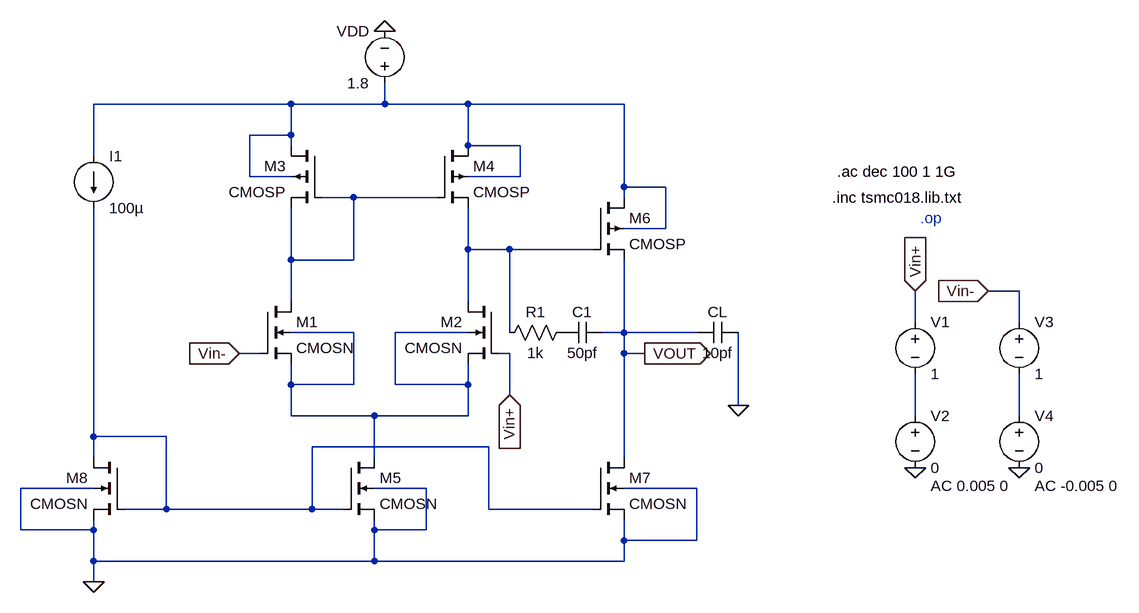
[diagram p0: schematic 2_stage_cmos_opamp.asc]
2_stage_cmos_opamp.asc, the LTspice schematic file:
Version 4.1
SHEET 1 1956 884
WIRE 672 -48 368 -48
WIRE 816 -48 816 -80
WIRE 816 -48 672 -48
WIRE 944 -48 816 -48
WIRE 1184 -48 944 -48
WIRE 672 0 672 -48
WIRE 672 0 608 0
WIRE 672 16 672 0
WIRE 944 16 944 -48
WIRE 1024 16 944 16
WIRE 368 32 368 -48
WIRE 608 64 608 0
WIRE 672 64 608 64
WIRE 1024 64 1024 16
WIRE 1024 64 944 64
WIRE 1184 80 1184 -48
WIRE 1248 80 1184 80
WIRE 768 96 720 96
WIRE 896 96 768 96
WIRE 1184 96 1184 80
WIRE 1248 144 1248 80
WIRE 1248 144 1184 144
WIRE 944 176 944 112
WIRE 1008 176 944 176
WIRE 1136 176 1008 176
WIRE 672 192 672 112
WIRE 768 192 768 96
WIRE 768 192 672 192
WIRE 1792 240 1744 240
WIRE 672 256 672 192
WIRE 944 256 944 176
WIRE 1632 288 1632 240
WIRE 1792 288 1792 240
WIRE 768 304 672 304
WIRE 944 304 832 304
WIRE 1008 304 1008 176
WIRE 1184 304 1184 192
WIRE 1184 304 1152 304
WIRE 1296 304 1184 304
WIRE 624 336 592 336
WIRE 1008 336 992 336
WIRE 1184 336 1184 304
WIRE 1216 336 1184 336
WIRE 672 384 672 352
WIRE 768 384 768 304
WIRE 768 384 672 384
WIRE 832 384 832 304
WIRE 944 384 944 352
WIRE 944 384 832 384
WIRE 1008 400 1008 336
WIRE 1360 416 1360 304
WIRE 672 432 672 384
WIRE 800 432 672 432
WIRE 944 432 944 384
WIRE 944 432 800 432
WIRE 1632 432 1632 368
WIRE 1792 432 1792 368
WIRE 368 464 368 112
WIRE 480 464 368 464
WIRE 976 480 704 480
WIRE 368 496 368 464
WIRE 800 496 800 432
WIRE 1184 496 1184 336
WIRE 368 544 256 544
WIRE 880 544 800 544
WIRE 1296 544 1184 544
WIRE 480 576 480 464
WIRE 480 576 416 576
WIRE 704 576 704 480
WIRE 704 576 480 576
WIRE 752 576 704 576
WIRE 976 576 976 480
WIRE 1136 576 976 576
WIRE 256 608 256 544
WIRE 368 608 368 592
WIRE 368 608 256 608
WIRE 800 608 800 592
WIRE 880 608 880 544
WIRE 880 608 800 608
WIRE 1184 624 1184 592
WIRE 1296 624 1296 544
WIRE 1296 624 1184 624
WIRE 368 656 368 608
WIRE 800 656 800 608
WIRE 800 656 368 656
WIRE 1184 656 1184 624
WIRE 1184 656 800 656
WIRE 368 688 368 656
FLAG 816 -160 0
FLAG 368 688 0
FLAG 1360 416 0
FLAG 592 336 Vin-
IOPIN 592 336 In
FLAG 1008 400 Vin+
IOPIN 1008 400 In
FLAG 1216 336 VOUT
IOPIN 1216 336 Out
FLAG 1632 240 Vin+
IOPIN 1632 240 In
FLAG 1744 240 Vin-
IOPIN 1744 240 In
FLAG 1632 512 0
FLAG 1792 512 0
SYMBOL voltage 816 -64 R180
WINDOW 0 24 96 Left 2
WINDOW 3 24 16 Left 2
SYMATTR InstName VDD
SYMATTR Value 1.8
SYMBOL nmos4 624 256 R0
SYMATTR InstName M1
SYMATTR Value CMOSN
SYMATTR Value2 l=0.5u w=20u
SYMBOL nmos4 992 256 M0
SYMATTR InstName M2
SYMATTR Value CMOSN
SYMATTR Value2 l=0.5u w=20u
SYMBOL nmos4 1136 496 R0
SYMATTR InstName M7
SYMATTR Value CMOSN
SYMATTR Value2 l=0.5u w=7u
SYMBOL nmos4 416 496 M0
SYMATTR InstName M8
SYMATTR Value CMOSN
SYMATTR Value2 l=0.72u w=10u
SYMBOL current 368 32 R0
WINDOW 123 0 0 Left 0
WINDOW 39 0 0 Left 0
SYMATTR InstName I1
SYMATTR Value 100µ
SYMBOL pmos4 1136 96 R0
SYMATTR InstName M6
SYMATTR Value CMOSP
SYMATTR Value2 l=0.5u w=40u
SYMBOL cap 1360 288 R90
WINDOW 0 0 32 VBottom 2
WINDOW 3 32 32 VTop 2
SYMATTR InstName CL
SYMATTR Value 10pf
SYMBOL cap 1152 288 R90
WINDOW 0 0 32 VBottom 2
WINDOW 3 32 32 VTop 2
SYMATTR InstName C1
SYMATTR Value 50pf
SYMBOL nmos4 752 496 R0
SYMATTR InstName M5
SYMATTR Value CMOSN
SYMATTR Value2 l=0.72u w=10u
SYMBOL pmos4 720 16 M0
SYMATTR InstName M3
SYMATTR Value CMOSP
SYMATTR Value2 l=0.72u w=30u
SYMBOL pmos4 896 16 R0
SYMATTR InstName M4
SYMATTR Value CMOSP
SYMATTR Value2 l=0.72u w=30u
SYMBOL res 1104 288 R90
WINDOW 0 0 56 VBottom 2
WINDOW 3 32 56 VTop 2
SYMATTR InstName R1
SYMATTR Value 1k
SYMBOL voltage 1632 272 R0
SYMATTR InstName V1
SYMATTR Value 1
SYMBOL voltage 1632 416 R0
WINDOW 123 24 124 Left 2
WINDOW 39 0 0 Left 0
SYMATTR InstName V2
SYMATTR Value 0
SYMATTR Value2 AC 0.005 0
SYMBOL voltage 1792 272 R0
SYMATTR InstName V3
SYMATTR Value 1
SYMBOL voltage 1792 416 R0
WINDOW 123 24 124 Left 2
WINDOW 39 0 0 Left 0
SYMATTR InstName V4
SYMATTR Value 0
SYMATTR Value2 AC -0.005 0
TEXT 1640 128 Left 2 ;.op
TEXT 1504 96 Left 2 !.inc tsmc018.lib.txt
TEXT 1512 56 Left 2 !.ac dec 100 1 1G

The netlist it stands for:
* 2_stage_cmos_opamp.asc
VDD N001 0 1.8
M1 N002 Vin- N004 N004 CMOSN l=0.5u w=20u
M2 N003 Vin+ N004 N004 CMOSN l=0.5u w=20u
M7 VOUT N007 0 0 CMOSN l=0.5u w=7u
M8 N007 N007 0 0 CMOSN l=0.72u w=10u
I1 N001 N007 100µ
M6 N001 N003 VOUT N001 CMOSP l=0.5u w=40u
CL 0 VOUT 10pf
C1 VOUT P001 50pf
M5 N004 N007 0 0 CMOSN l=0.72u w=10u
M3 N001 N002 N002 N001 CMOSP l=0.72u w=30u
M4 N001 N002 N003 N001 CMOSP l=0.72u w=30u
R1 P001 N003 1k
V1 Vin+ N005 1
V2 N005 0 0 AC 0.005 0
V3 Vin- N006 1
V4 N006 0 0 AC -0.005 0
.model NMOS NMOS
.model PMOS PMOS
.lib standard.mos
* .op
.inc tsmc018.lib.txt
.ac dec 100 1 1G
.backanno
.end